# Altium schematic sheet Regulators.SchDoc
size A4
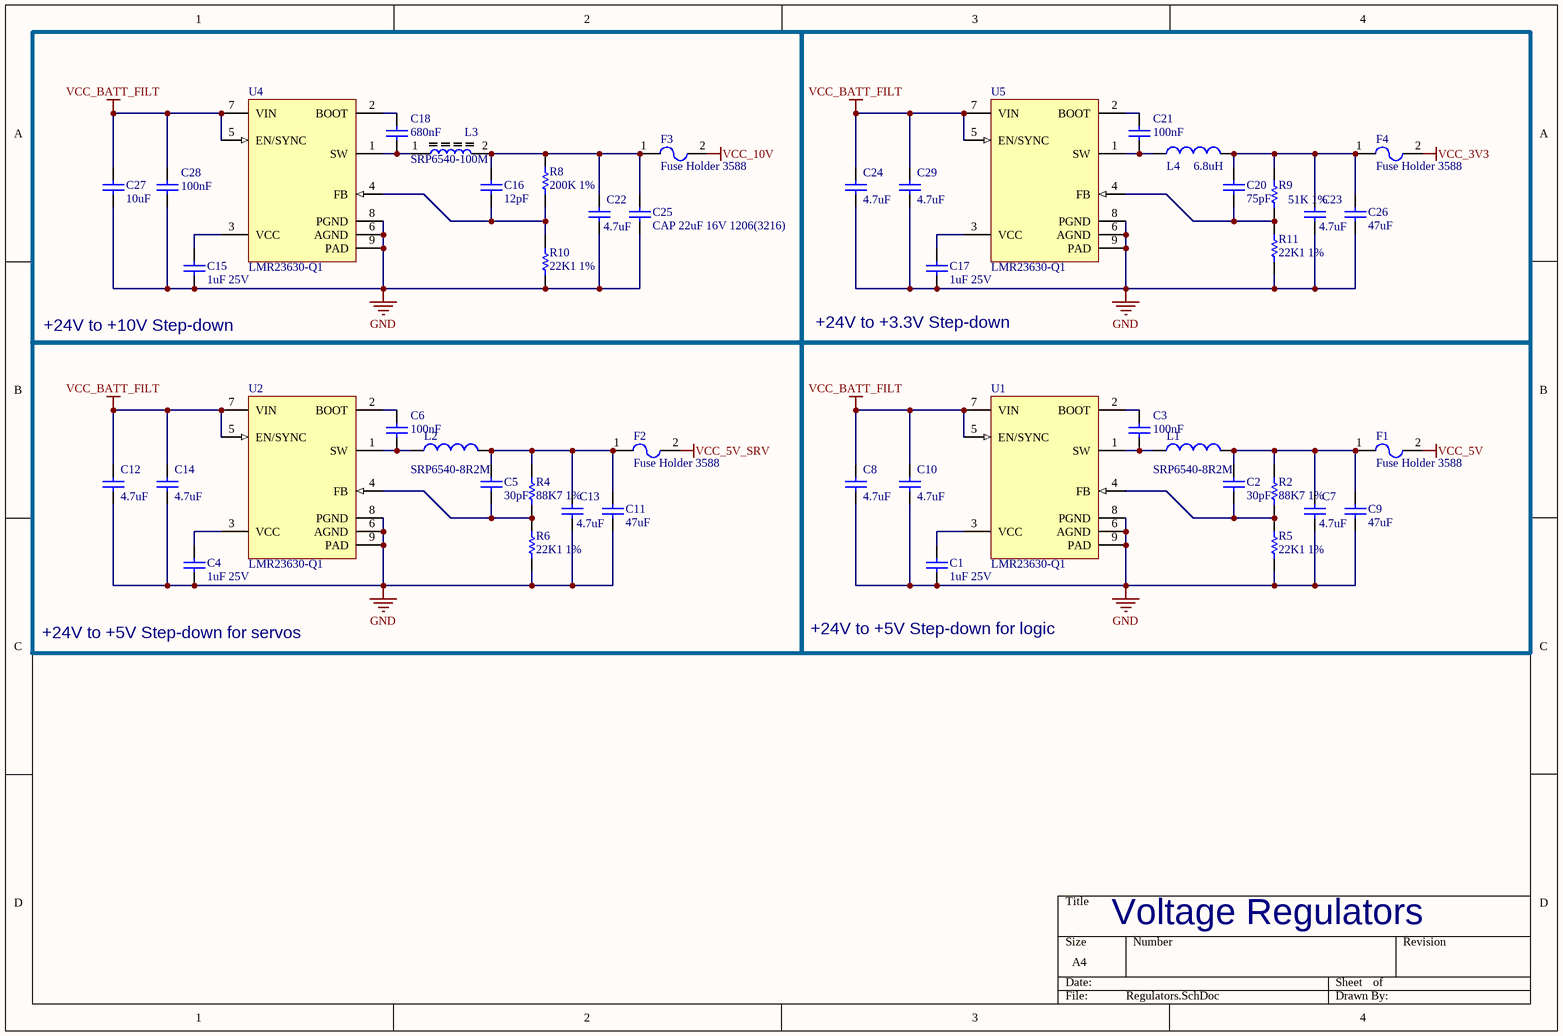
[diagram p0: Regulators.SchDoc]

## Parts
C1  1uF 25V  [CAPC0603(1608)100_L]
C2  30pF  [CAPC0603(1608)100_L]
C3  100nF  [CAPC0603(1608)100_L]
C4  1uF 25V  [CAPC0603(1608)100_L]
C5  30pF  [CAPC0603(1608)100_L]
C6  100nF  [CAPC0603(1608)100_L]
C7  4.7uF  [CAPC1206(3216)190_L]
C8  4.7uF  [CAPC1206(3216)190_L]
C9  47uF  [CAPC1206(3216)190_L]
C10  4.7uF  [CAPC1206(3216)190_L]
C11  47uF  [CAPC1206(3216)190_L]
C12  4.7uF  [CAPC1206(3216)190_L]
C13  4.7uF  [CAPC1206(3216)190_L]
C14  4.7uF  [CAPC1206(3216)190_L]
C15  1uF 25V  [CAPC0603(1608)100_L]
C16  12pF  [CAPC0603(1608)100_L]
C17  1uF 25V  [CAPC0603(1608)100_L]
C18  680nF  [CAPC0603(1608)100_L]
C20  75pF  [CAPC0603(1608)100_L]
C21  100nF  [CAPC0603(1608)100_L]
C22  4.7uF  [CAPC1206(3216)190_L]
C23  4.7uF  [CAPC1206(3216)190_L]
C24  4.7uF  [CAPC1206(3216)190_L]
C25  CAP 22uF 16V 1206(3216)  [CAPC1206(3216)190_L]
C26  47uF  [CAPC1206(3216)190_L]
C27  10uF  [CAPC1206(3216)190_L]
C28  100nF  [CAPC0603(1608)100_L]
C29  4.7uF  [CAPC1206(3216)190_L]
F1  Fuse Holder 3588  [Fuse Holder 3588]
F2  Fuse Holder 3588  [Fuse Holder 3588]
F3  Fuse Holder 3588  [Fuse Holder 3588]
F4  Fuse Holder 3588  [Fuse Holder 3588]
L1  SRP6540-8R2M  [BOURNS SRP5030T]
L2  SRP6540-8R2M  [BOURNS SRP5030T]
L3  SRP6540-100M  [IND_SRP6540-100M]
L4  6.8uH  [BOURNS SRP5030T]
R2  88K7 1%  [RESC0603(1608)_L]
R4  88K7 1%  [RESC0603(1608)_L]
R5  22K1 1%  [RESC0603(1608)_L]
R6  22K1 1%  [RESC0603(1608)_L]
R8  200K 1%  [RESC0603(1608)_L]
R9  51K 1%  [RESC0603(1608)_L]
R10  22K1 1%  [RESC0603(1608)_L]
R11  22K1 1%  [RESC0603(1608)_L]
U1  LMR23630-Q1  [DDA0008E_N]
U2  LMR23630-Q1  [DDA0008E_N]
U4  LMR23630-Q1  [DDA0008E_N]
U5  LMR23630-Q1  [DDA0008E_N]

## Blocks framed on the sheet
+24V to +10V Step-down: C15 C16 C18 C22 C25 C27 C28 F3 L3 R8 R10 U4
+24V to +3.3V Step-down: C17 C20 C21 C23 C24 C26 C29 F4 L4 R9 R11 U5
+24V to +5V Step-down for servos: C4-C6 C11-C14 F2 L2 R4 R6 U2
+24V to +5V Step-down for logic: C1-C3 C7-C10 F1 L1 R2 R5 U1

## Nets
GND: C1.1 C4.1 C7.1 C8.1 C9.1 C10.1 C11.1 C12.1 C13.1 C14.1 C15.1 C17.1 C22.1 C23.1 C24.1 C25.1 C26.1 C27.1 C28.1 C29.1 R5.1 R6.1 R10.1 R11.1 U1.6(AGND) U1.8(PGND) U1.9(PAD) U2.6(AGND) U2.8(PGND) U2.9(PAD) U4.6(AGND) U4.8(PGND) U4.9(PAD) U5.6(AGND) U5.8(PGND) U5.9(PAD)
VCC_3V3: F4.2
VCC_5V: F1.2
VCC_5V_SRV: F2.2
VCC_10V: F3.2
VCC_BATT_FILT: C8.2 C10.2 C12.2 C14.2 C24.2 C27.2 C28.2 C29.2 U1.5(EN/SYNC) U1.7(VIN) U2.5(EN/SYNC) U2.7(VIN) U4.5(EN/SYNC) U4.7(VIN) U5.5(EN/SYNC) U5.7(VIN)
NetC1_2: C1.2 U1.3(VCC)
NetC2_1: C2.1 R2.1 R5.2 U1.4(FB)
NetC2_2: C2.2 C7.2 C9.2 F1.1 L1.2 R2.2
NetC3_1: C3.1 L1.1 U1.1(SW)
NetC3_2: C3.2 U1.2(BOOT)
NetC4_2: C4.2 U2.3(VCC)
NetC5_1: C5.1 R4.1 R6.2 U2.4(FB)
NetC5_2: C5.2 C11.2 C13.2 F2.1 L2.2 R4.2
NetC6_1: C6.1 L2.1 U2.1(SW)
NetC6_2: C6.2 U2.2(BOOT)
NetC15_2: C15.2 U4.3(VCC)
NetC16_1: C16.1 R8.1 R10.2 U4.4(FB)
NetC16_2: C16.2 C22.2 C25.2 F3.1 L3.2 R8.2
NetC17_2: C17.2 U5.3(VCC)
NetC18_1: C18.1 L3.1 U4.1(SW)
NetC18_2: C18.2 U4.2(BOOT)
NetC20_1: C20.1 R9.1 R11.2 U5.4(FB)
NetC20_2: C20.2 C23.2 C26.2 F4.1 L4.2 R9.2
NetC21_1: C21.1 L4.1 U5.1(SW)
NetC21_2: C21.2 U5.2(BOOT)

## Notes on the sheet
- Voltage Regulators

## Library data of the parts
C1 C4 C15 C17 = CMP-1035-02740-1: CAP 1uF 25V ±10% 0603 (1608 Metric) Thickness 1mm SMD; Tolerance: Â±10%; Case-Metric: 1608; Case-EIA: 0603; Technology: SMT; Rated Voltage: 25 V; Max Thickness: 1 mm; Value: 1uF
C2 C5 = CMP-1035-00915-1: CAP 30pF 50V ±10% 0603 (1608 Metric) Thickness 1mm SMD; Tolerance: Â±10%; Case-Metric: 1608; Case-EIA: 0603; Rated Voltage: 50 V; Technology: SMT; Value: 30pF; Max Thickness: 1 mm
C3 C6 C21 C28 = CMP-1035-02595-1: CAP 100nF 100V ±10% 0603 (1608 Metric) Thickness 1mm SMD; Tolerance: Â±10%; Case-EIA: 0603; Case-Metric: 1608; Rated Voltage: 100 V; Value: 100nF; Technology: SMT; Max Thickness: 1 mm
C7 C8 C10 C12-C14 C22-C24 C29 = CMP-1037-04922-1: CAP 4.7uF 35V ±10% 1206 (3216 Metric) Thickness 1.9mm SMD; Case-EIA: 1206; Tolerance: Â±10%; Case-Metric: 3216; Rated Voltage: 35 V; Technology: SMT; Value: 4.7uF; Max Thickness: 1.9 mm
  C7 C13 C22 C23: Supplier 1: Digi-Key
C9 C11 C26 = CMP-1037-05003-1: CAP 47uF 16V ±20% 1206 (3216 Metric) Thickness 1.9mm SMD; Case-EIA: 1206; Tolerance: Â±20%; Case-Metric: 3216; Rated Voltage: 16 V; Technology: SMT; Value: 47uF; Max Thickness: 1.9 mm
C16 = CMP-1035-00615-1: CAP 12pF 50V ±0.25pF 0603 (1608 Metric) Thickness 1mm SMD; Tolerance: Â±0.25pF; Case-EIA: 0603; Case-Metric: 1608; Max Thickness: 1 mm; Rated Voltage: 50 V; Value: 12pF; Technology: SMT
C18 = CMP-1035-02724-1: CAP 680nF 50V ±10% 0603 (1608 Metric) Thickness 1mm SMD; Tolerance: Â±10%; Case-EIA: 0603; Case-Metric: 1608; Technology: SMT; Value: 680nF; Max Thickness: 1 mm; Rated Voltage: 50 V
C20 = CMP-1035-01189-1: CAP 75pF 25V ±1% 0603 (1608 Metric) Thickness 1mm SMD; Case-Metric: 1608; Case-EIA: 0603; Tolerance: Â±1%; Rated Voltage: 25 V; Technology: SMT; Max Thickness: 1 mm; Value: 75pF
C25 = CMP-1037-04993-1: CAP 22uF 16V ±20% 1206 (3216 Metric) Thickness 1.9mm SMD; Tolerance: Â±20%; Case-Metric: 3216; Case-EIA: 1206; Value: 22uF; Rated Voltage: 16 V; Technology: SMT; Max Thickness: 1.9 mm
C27 = CMP-1037-04982-1: CAP 10uF 50V ±10% 1206 (3216 Metric) Thickness 1.9mm SMD; Case-EIA: 1206; Tolerance: Â±10%; Case-Metric: 3216; Technology: SMT; Max Thickness: 1.9 mm; Value: 10uF; Rated Voltage: 50 V
F1-F4 = 3588 Fuse Holder: Keystone Electronics 3588; Supplier 1: Digi-Key; Supplier Part Number 1: 36-3588-ND; Datasheet: http://keyelco.com/userAssets/file/M65p43.pdf
L1 L2 = SRP5030TA_8R2: ComponentLink1URL: http://www.bourns.com/docs/Product-Datasheets/SRP5030TA.pdf; ComponentLink1Description: http://www.bourns.com/docs/Product-Datasheets/SRP5030TA.pdf; Supplier 1: Digi-Key; Supplier Part Number 1: SRP6540-8R2MCT-ND
L3 = SRP6540-100M: Inductor Power Shielded/Molded Wirewound 10uH 20% 100KHz Powdered Iron 4A 78.5mOhm DCR T/R; MF: Bourns; Digi-Key_Part_Number: SRP6540-100MCT-ND; SnapEDA_Link: https://www.snapeda.com/parts/SRP6540-100M/Bourns/view-part/?ref=snap; Package: Nonstandard Bourns; MP: SRP6540-100M; Digi-Key_Purchase_URL: https://www.digikey.com/product-detail/en/bourns-inc/SRP6540-100M/SRP6540-100MCT-ND/3986041?utm_source=snapeda&utm_medium=aggregator&utm_campaign=symbol; Value: *
L4 = SRP5030TA: Manufacturer: Bourns Inc.; Manufacturer Part Number: SRP5030TA-6R8M; Type: Wirewound; Material - Core: Carbonyl Powder; Tolerance: ±20%; Shielding: Shielded; DC Resistance (DCR): 76.2 mOhm Max; Q @ Freq: 15 @ 100kHz; Supplier 1: Digi-Key; RoHS: RoHS Compliant; Category: Inductors, Coils, Chokes; Stock 1: 5626; Pricing 1: 1=1.51, 10=1.397, 100=0.9781, 500=0.79178, 1000=0.72191 (USD); Packaging: Cut Tape (CT); Part Status: Active; Ratings: AEC-Q200; Operating Temperature: -40°C ~ 150°C; Mounting Type: Surface Mount; Package / Case: Nonstandard; Supplier Device Package: -; Size / Dimension: 0.224" L x 0.205" W (5.70mm x 5.20mm); Height - Seated (Max): 0.118" (3.00mm); ComponentLink1URL: http://www.bourns.com/docs/Product-Datasheets/SRP5030TA.pdf; ComponentLink1Description: http://www.bourns.com/docs/Product-Datasheets/SRP5030TA.pdf; Supplier Part Number 1: SRP5030TA-6R8MCT-ND
R2 R4 = CMP-1012-00730-1: 88K7 0.1W 1% 0603 (1608 Metric)  SMD; Value: 88700.00 Ohm; Case-Metric: 1608; Case-EIA: 0603; Tolerance: 1 %; Power: 0.1 W; Technology: SMT
R5 R6 R10 R11 = CMP-1012-00660-1: 22K1 0.1W 1% 0603 (1608 Metric)  SMD; Case-EIA: 0603; Case-Metric: 1608; Value: 22100.00 Ohm; Tolerance: 1 %; Power: 0.1 W; Technology: SMT
R8 = CMP-1012-00768-1: 200K 0.1W 1% 0603 (1608 Metric)  SMD; Case-Metric: 1608; Value: 200000.00 Ohm; Case-EIA: 0603; Power: 0.1 W; Technology: SMT; Tolerance: 1 %
R9 = CMP-1012-00703-1: 51K 0.1W 1% 0603 (1608 Metric)  SMD; Case-EIA: 0603; Case-Metric: 1608; Value: 51000.00 Ohm; Tolerance: 1 %; Technology: SMT; Power: 0.1 W
U1 U2 U4 U5 = LMR23630-Q1: Manufacturer: Texas Instruments; Manufacturer Part Number: LMR23630AFQDDARQ1; Function: Step-Down; Output Configuration: Positive; Topology: Buck; Output Type: Adjustable; Number of Outputs: 1; Voltage - Input (Min): 4.5V; Voltage - Input (Max): 36V; Voltage - Output (Min/Fixed): 1V; Voltage - Output (Max): 28V; Current - Output: 3A; Frequency - Switching: 400kHz; Synchronous Rectifier: Yes; Supplier 1: Digi-Key; RoHS: RoHS Compliant; Category: Integrated Circuits (ICs); Stock 1: 1636; Pricing 1: 1=3.97, 10=3.564, 100=2.9204, 500=2.48604, 1000=2.09667 (USD); Packaging: Digi-Reel®; Part Status: Active; Operating Temperature: -40°C ~ 125°C (TJ); Mounting Type: Surface Mount; Package / Case: 8-SOIC (0.154", 3.90mm Width) Exposed Pad; Supplier Device Package: 8-SO PowerPad; ComponentLink1URL: http://www.ti.com/lit/ds/symlink/lmr23630-q1.pdf; ComponentLink1Description: http://www.ti.com/lit/ds/symlink/lmr23630-q1.pdf; Supplier Part Number 1: 296-45260-6-ND